# EAGLE design MBED_BBB (EAGLE 6.2)
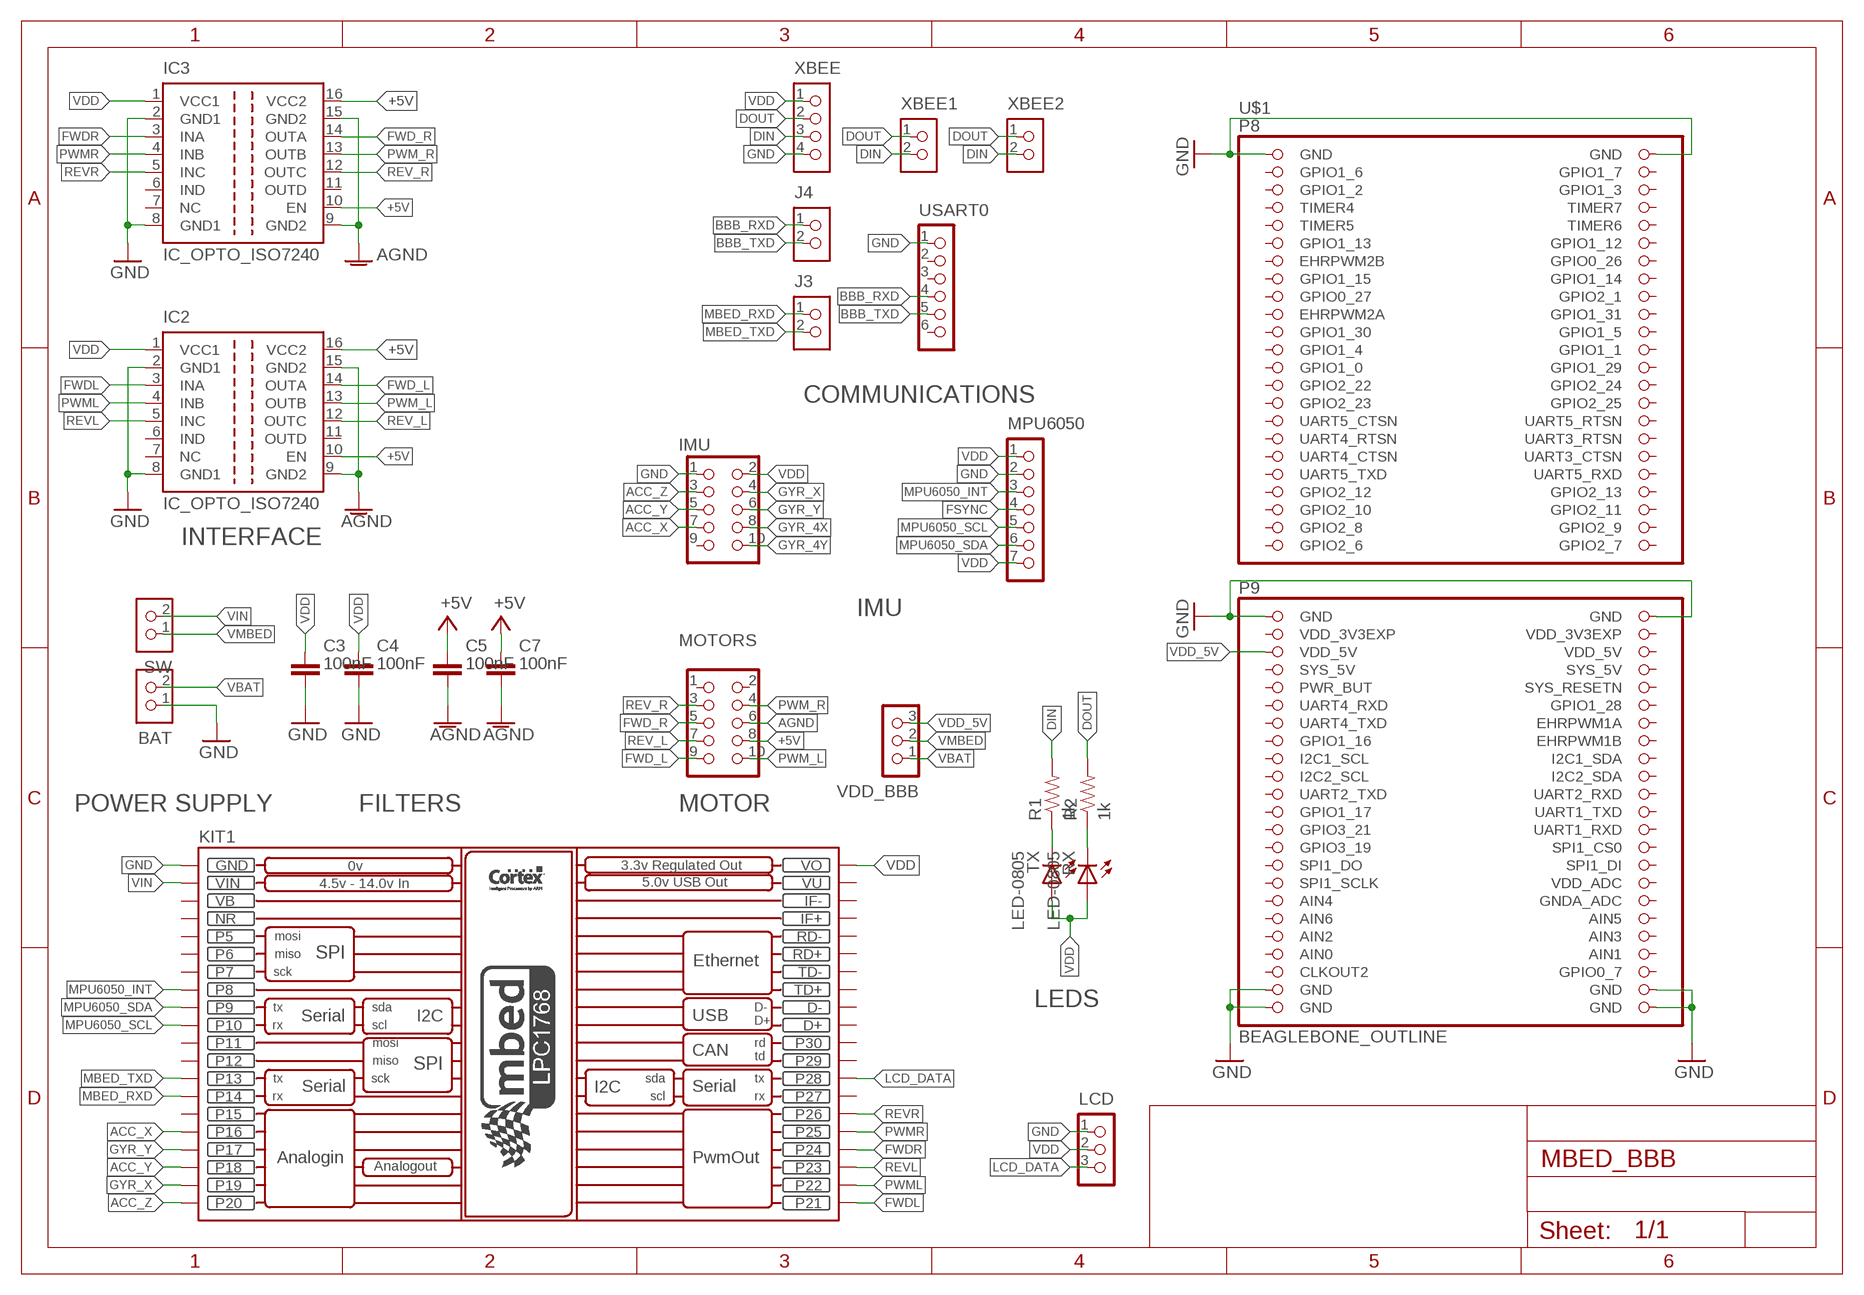
[diagram p0: schematic, sheet 1]

## Parts
BAT  CON_HEADER_1X02-PTH-M  [M1X02_M]
C3  100nF  CAPACITOR-0603  [C0603]
C4  100nF  CAPACITOR-0603  [C0603]
C5  100nF  CAPACITOR-0603  [C0603]
C7  100nF  CAPACITOR-0603  [C0603]
IC2  IC_OPTO_ISO7240  [SOIC-16DW]
IC3  IC_OPTO_ISO7240  [SOIC-16DW]
IMU  CON_HEADER_2X05-PTH+SHROUDED_A  [PINSHRD_PTH_2X05]
J3  CON_HEADER_1X02-PTH-M  [M1X02_M]
J4  CON_HEADER_1X02-PTH-M  [M1X02_M]
KIT1  MBED-SOCKET  [MBED-SOCKET]
LCD  CON_HEADER_1X03-PTH_M  [M1X03_M]
MOTORS  CON_HEADER_2X05-PTH+SHROUDED_A  [PINSHRD_PTH_2X05]
MPU6050  CON_HEADER_1X07-PTH_M  [M1X07_M]
R1  1k  RESISTOR-0603  [R0603]
R2  1k  RESISTOR-0603  [R0603]
RX  LED-0805  [LED-0805]
SW  CON_HEADER_1X02-PTH-POLAR  [M1X02_P]
TX  LED-0805  [LED-0805]
U$1  BEAGLEBONE_OUTLINE  [BEAGLEBONE_SHIELD]
USART0  CON_HEADER_1X06-PTH_M  [M1X06_M]
VDD_BBB  CON_HEADER_1X03-PTH_M  [M1X03_M]
XBEE  CON_HEADER_1X04-PTH_M  [M1X04_M]
XBEE1  CON_HEADER_1X02-PTH-M  [M1X02_M]
XBEE2  CON_HEADER_1X02-PTH-M  [M1X02_M]

## Nets
+5V: C5.1 C7.1 IC2.10(EN) IC2.16(VCC2) IC3.10(EN) IC3.16(VCC2) MOTORS.8
ACC_X: IMU.7 KIT1.P16
ACC_Y: IMU.5 KIT1.P18
ACC_Z: IMU.3 KIT1.P20
AGND: C5.2 C7.2 IC2.9(GND2) IC2.15(GND2) IC3.9(GND2) IC3.15(GND2) MOTORS.6
BBB_RXD: J4.1 USART0.4
BBB_TXD: J4.2 USART0.5
DIN: R1.2 XBEE1.2 XBEE2.2 XBEE.3
DOUT: R2.2 XBEE1.1 XBEE2.1 XBEE.2
FSYNC: MPU6050.4
FWD_L: IC2.14(OUTA) MOTORS.9
FWD_R: IC3.14(OUTA) MOTORS.5
FWDL: IC2.3(INA) KIT1.P21
FWDR: IC3.3(INA) KIT1.P24
GND: BAT.1 C3.2 C4.2 IC2.2(GND1) IC2.8(GND1) IC3.2(GND1) IC3.8(GND1) IMU.1 KIT1.GND LCD.1 MPU6050.2 U$1.1(GND) U$1.2(GND) U$1.47(GND) U$1.48(GND) U$1.89(GND) U$1.90(GND) U$1.91(GND) U$1.92(GND) USART0.1 XBEE.4
GYR_4X: IMU.8
GYR_4Y: IMU.10
GYR_X: IMU.4 KIT1.P19
GYR_Y: IMU.6 KIT1.P17
LCD_DATA: KIT1.P28 LCD.3
MBED_RXD: J3.1 KIT1.P14
MBED_TXD: J3.2 KIT1.P13
MPU6050_INT: KIT1.P8 MPU6050.3
MPU6050_SCL: KIT1.P10 MPU6050.5
MPU6050_SDA: KIT1.P9 MPU6050.6
PWM_L: IC2.13(OUTB) MOTORS.10
PWM_R: IC3.13(OUTB) MOTORS.4
PWML: IC2.4(INB) KIT1.P22
PWMR: IC3.4(INB) KIT1.P25
REV_L: IC2.12(OUTC) MOTORS.7
REV_R: IC3.12(OUTC) MOTORS.3
REVL: IC2.5(INC) KIT1.P23
REVR: IC3.5(INC) KIT1.P26
RX_LED: R2.1 RX.C
TX_LED: R1.1 TX.C
VBAT: BAT.2 VDD_BBB.1
VDD: C3.1 C4.1 IC2.1(VCC1) IC3.1(VCC1) IMU.2 KIT1.VOUT(VO) LCD.2 MPU6050.1 MPU6050.7 RX.A TX.A XBEE.1
VDD_5V: U$1.51(VDD_5V) VDD_BBB.3
VIN: KIT1.VIN SW.2
VMBED: SW.1 VDD_BBB.2
Unconnected: IC2.6(IND) IC2.7(NC) IC2.11(OUTD) IC3.6(IND) IC3.7(NC) IC3.11(OUTD) IMU.9 KIT1.D+ KIT1.D- KIT1.IF+ KIT1.IF- KIT1.P5 KIT1.P6 KIT1.P7 KIT1.P11 KIT1.P12 KIT1.P15 KIT1.P27 KIT1.P29 KIT1.P30 KIT1.RD+ KIT1.RD- KIT1.TD+ KIT1.TD- MOTORS.1 MOTORS.2 U$1.3(GPIO1_6) U$1.4(GPIO1_7) U$1.5(GPIO1_2) U$1.6(GPIO1_3) U$1.7(TIMER4) U$1.8(TIMER7) U$1.9(TIMER5) U$1.10(TIMER6) U$1.11(GPIO1_13) U$1.12(GPIO1_12) U$1.13(EHRPWM2B) U$1.14(GPIO0_26) U$1.15(GPIO1_15) U$1.16(GPIO1_14) U$1.17(GPIO0_27) U$1.18(GPIO2_1) U$1.19(EHRPWM2A) U$1.20(GPIO1_31) U$1.21(GPIO1_30) U$1.22(GPIO1_5) U$1.23(GPIO1_4) U$1.24(GPIO1_1) U$1.25(GPIO1_0) U$1.26(GPIO1_29) U$1.27(GPIO2_22) U$1.28(GPIO2_24) U$1.29(GPIO2_23) U$1.30(GPIO2_25) U$1.31(UART5_CTSN) U$1.32(UART5_RTSN) U$1.33(UART4_RTSN) U$1.34(UART3_RTSN) U$1.35(UART4_CTSN) U$1.36(UART3_CTSN) U$1.37(UART5_TXD) U$1.38(UART5_RXD) U$1.39(GPIO2_12) U$1.40(GPIO2_13) U$1.41(GPIO2_10) U$1.42(GPIO2_11) U$1.43(GPIO2_8) U$1.44(GPIO2_9) U$1.45(GPIO2_6) U$1.46(GPIO2_7) U$1.54(SYS_5V) U$1.55(PWR_BUT) U$1.56(SYS_RESETN) U$1.57(UART4_RXD) U$1.58(GPIO1_28) U$1.59(UART4_TXD) U$1.60(EHRPWM1A) U$1.61(GPIO1_16) U$1.62(EHRPWM1B) U$1.63(I2C1_SCL) U$1.64(I2C1_SDA) U$1.65(I2C2_SCL) U$1.66(I2C2_SDA) U$1.67(UART2_TXD) U$1.68(UART2_RXD) U$1.69(GPIO1_17) U$1.70(UART1_TXD) U$1.71(GPIO3_21) U$1.72(UART1_RXD) U$1.73(GPIO3_19) U$1.74(SPI1_CS0) U$1.75(SPI1_DO) U$1.76(SPI1_DI) U$1.77(SPI1_SCLK) U$1.78(VDD_ADC) U$1.79(AIN4) U$1.80(GNDA_ADC) U$1.81(AIN6) U$1.82(AIN5) U$1.83(AIN2) U$1.84(AIN3) U$1.86(AIN1) U$1.87(CLKOUT2) U$1.88(GPIO0_7) USART0.2 USART0.3 USART0.6

## Notes on the sheet
- COMMUNICATIONS
- INTERFACE
- IMU
- POWER SUPPLY | FILTERS | MOTOR
- LEDS

## Power pins joined to a net without a drawn wire
AIN0: U$1.85(AIN0)
NR: KIT1.NR
SYS_5V: U$1.53(SYS_5V)
VB: KIT1.VB
VDD_3V3EXP: U$1.49(VDD_3V3EXP) U$1.50(VDD_3V3EXP)
VDD_5V: U$1.52(VDD_5V)
VU: KIT1.VU

## Library data of the parts
BAT J3 J4 SW XBEE1 XBEE2 = gary:CON_HEADER_1X02
C3-C5 C7 = gary:CAPACITOR: Non-Polarized capacitor in various packages
IC2 IC3 = gary:IC_OPTO_ISO7240: HIGH SPEED QUAD DIGITAL ISOLATORS Source: http://focus.ti.com/lit/ds/symlink/iso7240m.pdf; MPN: ISO7240MDW; OC_FARNELL: 1755124; OC_NEWARK: 58M0385
IMU MOTORS = gary:CON_HEADER_2X05: 2x05 pin header
KIT1 = gary:MBED: Mbed LPC1768 - ARM CORTEX v2.1 * Schematic symbol is now placed in eagles's default raster. *The pads diameter are suitable for routing between mbed pins * mbed pads are 0.8 mm drill diameter. --------------------------------------------- Created by: Mohamed Yousry *Alexandria, Egypt *Email: mohamed.yousry@ieeegoldegypt.org
LCD VDD_BBB = gary:CON_HEADER_1X03
MPU6050 = gary:CON_HEADER_1X07
R1 R2 = gary:RESISTOR: Resistor Basic schematic elements and footprints for 0603, 1206, and PTH resistors.
RX TX = gary:LED: Light Emitting Diode
U$1 = gary:BEAGLEBONE_OUTLINE: Should match A3 pinout - but not completely tested
USART0 = gary:CON_HEADER_1X06
XBEE = gary:CON_HEADER_1X04

## Board
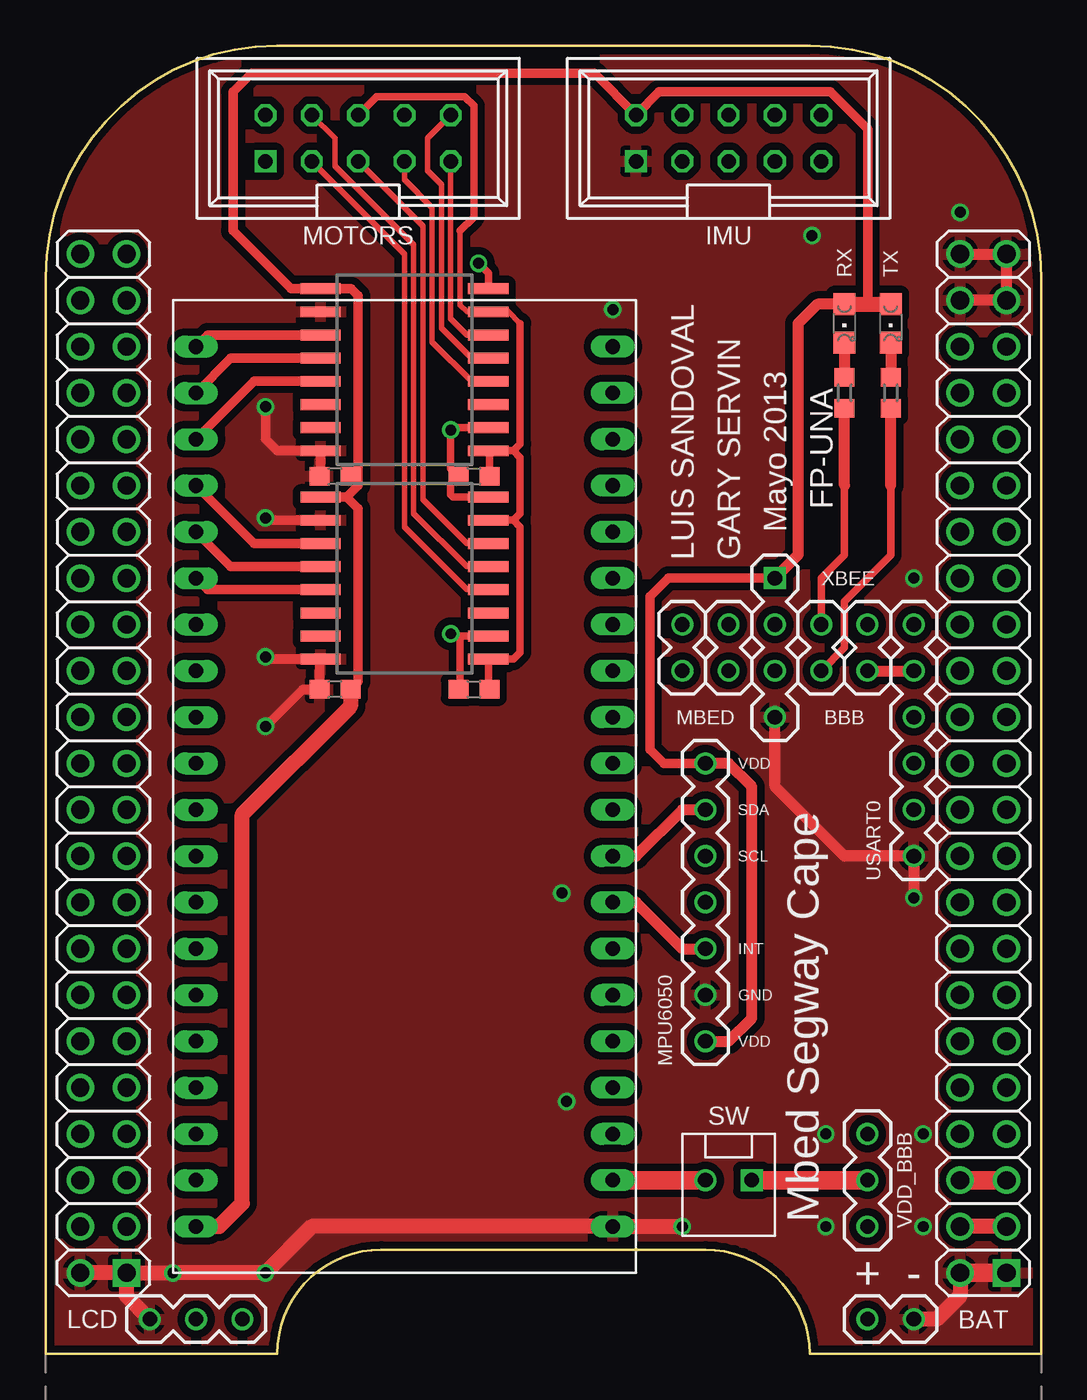
[diagram p1: board, top side]
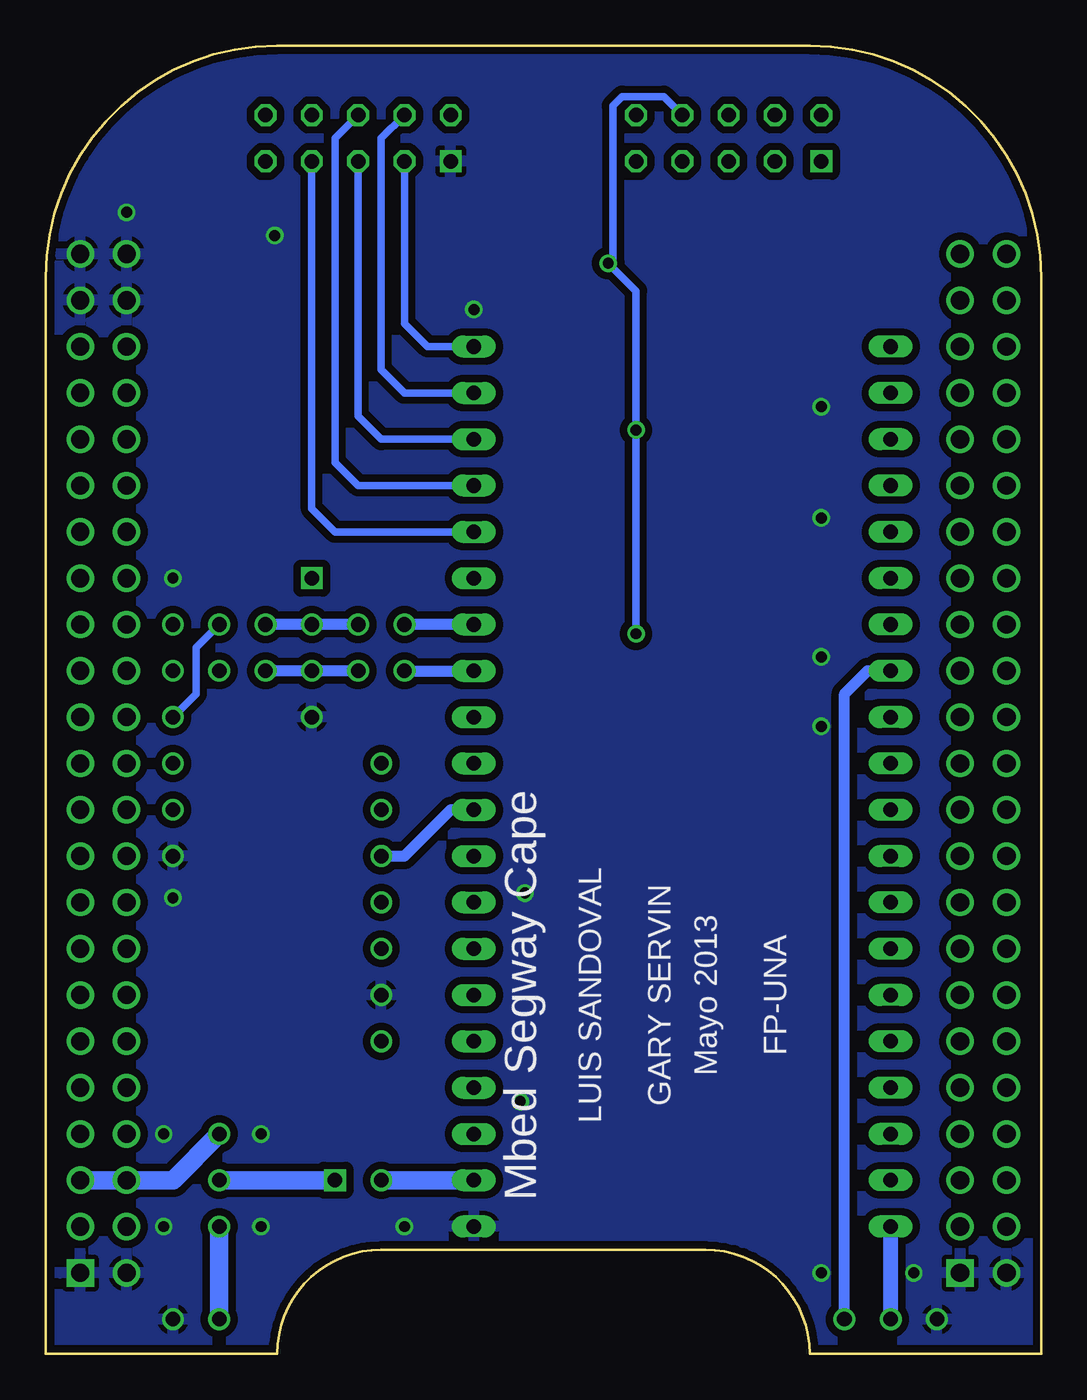
[diagram p2: board, bottom side, seen from below]

Size 54.61 x 71.75 mm. Coordinates in mm from the lower left corner, seen from the top.
Copper layers (1*16): Top 0.0356mm / dielectric 1.5011mm / Bottom 0.0356mm
Design rules: minimum track width 6mil, minimum drill 13mil, track to track 6mil, track to pad 6mil, pad to pad 6mil, via to via 6mil, smd to smd 6mil, copper to edge 15mil, drill to drill 6mil, minimum pad ring 7mil, minimum via ring 7mil, stop-mask expansion 4mil, vias tented up to drill 0mil, thermal gap 10mil

### Footprints (pad centres in the part's own frame; a part is rotated, then mirrored left to right if it is on the bottom)
M1X02_M = drill 0.8: 1 -1.27,0; 2 1.27,0
C0603 = smd 1.1 x 1: 1 -0.85,0; 2 0.85,0
SOIC-16DW = smd 0.6 x 2.2: 1 -4.445,-4.6; 2 -3.175,-4.6; 3 -1.905,-4.6; 4 -0.635,-4.6; 5 0.635,-4.6; 6 1.905,-4.6; 7 3.175,-4.6; 8 4.445,-4.6; 9 4.445,4.6; 10 3.175,4.6; 11 1.905,4.6; 12 0.635,4.6; 13 -0.635,4.6; 14 -1.905,4.6; 15 -3.175,4.6; 16 -4.445,4.6
PINSHRD_PTH_2X05 = drill 0.8 square: 1 -5.08,-1.27 | drill 0.8 octagon: 2 -5.08,1.27; 3 -2.54,-1.27; 4 -2.54,1.27; 5 0,-1.27; 6 0,1.27; 7 2.54,-1.27; 8 2.54,1.27; 9 5.08,-1.27; 10 5.08,1.27
MBED-SOCKET = drill 0.8 long: D+ 11.43,1.27; D- 11.43,3.81; GND -11.43,24.13; IF+ 11.43,16.51; IF- 11.43,19.05; NR -11.43,16.51; P5 -11.43,13.97; P6 -11.43,11.43; P7 -11.43,8.89; P8 -11.43,6.35; P9 -11.43,3.81; P10 -11.43,1.27; P11 -11.43,-1.27; P12 -11.43,-3.81; P13 -11.43,-6.35; P14 -11.43,-8.89; P15 -11.43,-11.43; P16 -11.43,-13.97; P17 -11.43,-16.51; P18 -11.43,-19.05; P19 -11.43,-21.59; P20 -11.43,-24.13; P21 11.43,-24.13; P22 11.43,-21.59; P23 11.43,-19.05; P24 11.43,-16.51; P25 11.43,-13.97; P26 11.43,-11.43; P27 11.43,-8.89; P28 11.43,-6.35; P29 11.43,-3.81; P30 11.43,-1.27; RD+ 11.43,11.43; RD- 11.43,13.97; TD+ 11.43,6.35; TD- 11.43,8.89; VB -11.43,19.05; VIN -11.43,21.59; VOUT 11.43,24.13; VU 11.43,21.59
M1X03_M = drill 0.8: 1 0,0; 2 2.54,0; 3 5.08,0
M1X07_M = drill 0.8: 1 -7.62,0; 2 -5.08,0; 3 -2.54,0; 4 0,0; 5 2.54,0; 6 5.08,0; 7 7.62,0
R0603 = smd 1 x 1.1: 1 -0.85,0; 2 0.85,0
LED-0805 = smd 1.2 x 1.2: A 0,-1.05; C 0,1.05
M1X02_P = drill 0.8 square: 1 0,0 | drill 0.8: 2 2.54,0
BEAGLEBONE_SHIELD = drill 1 square: 1 4.445,19.05; 47 52.705,19.05 | drill 1: 2 1.905,19.05; 3 4.445,21.59; 4 1.905,21.59; 5 4.445,24.13; 6 1.905,24.13; 7 4.445,26.67; 8 1.905,26.67; 9 4.445,29.21; 10 1.905,29.21; 11 4.445,31.75; 12 1.905,31.75; 13 4.445,34.29; 14 1.905,34.29; 15 4.445,36.83; 16 1.905,36.83; 17 4.445,39.37; 18 1.905,39.37; 19 4.445,41.91; 20 1.905,41.91; 21 4.445,44.45; 22 1.905,44.45; 23 4.445,46.99; 24 1.905,46.99; 25 4.445,49.53; 26 1.905,49.53; 27 4.445,52.07; 28 1.905,52.07; 29 4.445,54.61; 30 1.905,54.61; 31 4.445,57.15; 32 1.905,57.15; 33 4.445,59.69; 34 1.905,59.69; 35 4.445,62.23; 36 1.905,62.23; 37 4.445,64.77; 38 1.905,64.77; 39 4.445,67.31; 40 1.905,67.31; 41 4.445,69.85; 42 1.905,69.85; 43 4.445,72.39; 44 1.905,72.39; 45 4.445,74.93; 46 1.905,74.93; 48 50.165,19.05; 49 52.705,21.59; 50 50.165,21.59; 51 52.705,24.13; 52 50.165,24.13; 53 52.705,26.67; 54 50.165,26.67; 55 52.705,29.21; 56 50.165,29.21; 57 52.705,31.75; 58 50.165,31.75; 59 52.705,34.29; 60 50.165,34.29; 61 52.705,36.83; 62 50.165,36.83; 63 52.705,39.37; 64 50.165,39.37; 65 52.705,41.91; 66 50.165,41.91; 67 52.705,44.45; 68 50.165,44.45; 69 52.705,46.99; 70 50.165,46.99; 71 52.705,49.53; 72 50.165,49.53; 73 52.705,52.07; 74 50.165,52.07; 75 52.705,54.61; 76 50.165,54.61; 77 52.705,57.15; 78 50.165,57.15; 79 52.705,59.69; 80 50.165,59.69; 81 52.705,62.23; 82 50.165,62.23; 83 52.705,64.77; 84 50.165,64.77; 85 52.705,67.31; 86 50.165,67.31; 87 52.705,69.85; 88 50.165,69.85; 89 52.705,72.39; 90 50.165,72.39; 91 52.705,74.93; 92 50.165,74.93
M1X06_M = drill 0.8: 1 0,0; 2 2.54,0; 3 5.08,0; 4 7.62,0; 5 10.16,0; 6 12.7,0
M1X04_M = drill 0.8 square: 1 0,0 | drill 0.8: 2 2.54,0; 3 5.08,0; 4 7.62,0

### Placement (x,y rotation side)
BAT  46.36,1.91 180 top
C3  15.88,36.45 180 top
C4  15.88,48.13 180 top
C5  23.49,36.45 0 top
C7  23.49,48.13 0 top
IC2  19.68,53.98 270 top
IC3  19.68,42.55 270 top
IMU  37.47,66.67 0 top
J3  34.93,38.73 270 top
J4  45.09,38.73 270 top
KIT1  19.68,31.12 180 top
LCD  5.71,1.91 0 top
MOTORS  17.14,66.67 0 top
MPU6050  36.2,24.77 90 top
R1  46.36,52.71 270 top
R2  43.82,52.71 270 top
RX  43.82,56.52 180 top
SW  38.73,9.53 180 top
TX  46.36,56.52 180 top
U$1  0,-14.61 0 top
USART0  47.62,27.3 90 top
VDD_BBB  45.09,6.99 90 top
XBEE  40.01,42.55 270 top
XBEE1  42.55,38.73 270 top
XBEE2  37.47,38.73 270 top

### Tracks (layer width: path | path; a pad name or v marks a point on that pad's centre or on a via)
+5V  (via drill 0.6)
  Top 0.305: 22.35,39.37 v22.22,39.5
  Top 0.406: C5.1 22.73,36.54 22.73,39.37 | IC3.10 22.73,39.37 | 22.73,39.37 22.35,39.37 | IC2.10 22.35,50.8 v22.22,50.67 22.22,48.55 C7.1 22.22,47.71 22.22,47.12 22.35,46.99 IC3.16 | IC2.16 24.29,59.28 v23.75,59.82
  Bottom 0.406: MOTORS.8 20.7,68.96 22.99,68.96 23.49,68.45 23.49,60.07 v23.75,59.82 22.22,58.29 v22.22,50.67 v22.22,39.5
ACC_X
  Bottom 0.406: KIT1.P16 38.73,45.09 40.01,46.36 IMU.7
ACC_Y
  Bottom 0.406: KIT1.P18 36.2,50.16 37.47,51.44 IMU.5
ACC_Z
  Bottom 0.406: KIT1.P20 33.66,55.25 34.93,56.52 IMU.3
AGND
  Top 0.305: IC2.9 25.15,49.53 | 26.04,56.52 25.4,57.15 IC2.15 23.11,57.15 22.73,57.53 22.73,61.59
  Top 0.406: C5.2 24.29,36.51 IC3.9 25.65,38.1 26.04,38.48 26.04,45.34 25.65,45.72 | 26.04,56.52 26.04,49.91 25.65,49.53 | IC3.15 25.65,45.72 | MOTORS.6 18.16,68.96 22.99,68.96 23.49,68.45 23.49,62.36 22.73,61.59 | C7.2 24.34,49.47 IC2.9 | 25.65,45.72 26.04,46.1 26.04,49.15 25.65,49.53 | 25.15,49.53 25.65,49.53
BBB_RXD
  Bottom 0.406: USART0.4 46.36,36.2 46.36,38.73 J4.1
BBB_TXD
  Top 0.61: J4.2 USART0.5
DIN
  Top 0.406: XBEE1.2 43.82,38.73 43.82,41.27 46.36,43.82 46.36,47.62
  Top 0.61: 46.36,47.62 R1.2
  Bottom 0.61: XBEE2.2 XBEE.3 XBEE1.2
DOUT
  Top 0.406: 43.82,47.62 43.82,43.82 42.55,42.55 XBEE1.1
  Top 0.61: 43.82,47.62 R2.2
  Bottom 0.61: XBEE2.1 XBEE.2 XBEE1.1
FWD_L
  Top 0.305: IC2.14 23.11,55.88 22.22,56.77 MOTORS.9
FWD_R
  Top 0.305: IC3.14 23.11,44.45 20.7,46.86 20.7,61.85 MOTORS.5
FWDL
  Top 0.508: IC2.3 8.89,55.88 KIT1.P21
FWDR
  Top 0.508: IC3.3 11.43,44.45 KIT1.P24
GND  (via drill 0.6)
  Top 0.508: v12.06,51.94 12.06,50.16 12.7,49.53 IC2.8 15.09,48.19 C4.2 | IC3.2 12.19,45.72 v12.06,45.85 | v12.06,38.23 12.19,38.1 IC3.8 15.03,38.04 C3.2 14.1,36.45 v12.06,34.42
  Top 0.61: U$1.92 U$1.91 U$1.89 U$1.90 | v47.62,25.02 USART0.1 43.82,27.3 40.01,31.12 XBEE.4
  Top 0.813: U$1.1 U$1.2 | U$1.1 v6.99,4.45 v12.06,4.45 14.61,6.99 KIT1.GND v34.93,6.99 | LCD.1 4.45,3.18 U$1.1 | U$1.48 50.16,3.18 48.9,1.91 BAT.1
  Top 1.016: U$1.47 U$1.48
  other vias: 50.16,62.61 47.62,42.55 42.04,61.34 31.11,57.28 28.32,25.27 28.57,13.84 48.13,6.99 48.13,12.06 42.8,6.99 42.8,12.06
  pour Bottom (isolate 0.406): -0.64,-0.63 55.25,-0.63 55.25,71.75 -0.64,71.75
  pour Top (isolate 0.406): -0.64,-0.63 55.25,-0.63 55.25,71.75 -0.64,71.75
GYR_X
  Bottom 0.406: KIT1.P19 34.93,52.71 36.2,53.98 36.2,66.67 IMU.4
GYR_Y
  Bottom 0.406: KIT1.P17 37.47,47.62 38.73,48.9 38.73,66.67 IMU.6
LCD_DATA
  Bottom 0.61: KIT1.P28 9.53,37.47 10.79,36.2 LCD.3
MBED_RXD
  Bottom 0.61: KIT1.P14 J3.1
MBED_TXD
  Bottom 0.61: J3.2 KIT1.P13
MPU6050_INT
  Top 0.61: KIT1.P8 32.39,24.77 34.93,22.23 MPU6050.3
MPU6050_SCL
  Bottom 0.61: KIT1.P10 32.39,29.84 34.93,27.3 MPU6050.5
MPU6050_SDA
  Top 0.61: KIT1.P9 32.39,27.3 34.93,29.84 MPU6050.6
PWM_L
  Top 0.305: IC2.13 23.37,54.61 21.72,56.26 21.72,64.13 20.95,64.9 20.95,66.67 MOTORS.10
PWM_R
  Top 0.305: MOTORS.4 15.88,66.67 15.88,65.15 20.19,60.83 20.19,46.1 23.11,43.18 IC3.13
PWML
  Top 0.508: IC2.4 10.16,54.61 KIT1.P22
PWMR
  Top 0.508: IC3.4 10.16,43.18 KIT1.P25
REV_L
  Top 0.305: IC2.12 23.37,53.34 21.21,55.5 21.21,62.87 19.68,64.39 MOTORS.7
REV_R
  Top 0.305: MOTORS.3 19.68,60.33 19.68,45.34 23.11,41.91 IC3.12
REVL
  Top 0.508: IC2.5 11.43,53.34 KIT1.P23
REVR
  Top 0.508: IC3.5 8.89,41.91 KIT1.P26
RX_LED
  Top 0.61: RX.C R2.1
TX_LED
  Top 0.61: TX.C R1.1
VBAT
  Bottom 1.016: BAT.2 VDD_BBB.1
VDD
  Top 0.406: C3.1 16.89,36.45 | 15.2,47.11 IC3.1 | C4.1 17.14,48.13
  Top 0.508: 16.51,46.99 17.14,47.62 17.14,48.13 17.14,58.04 16.76,58.42 IC2.1 13.46,58.42 10.29,61.59 10.29,69.21 11.3,70.23 30.1,70.23 IMU.2 33.66,69.21 43.05,69.21 45.1,67.17 45.1,57.57 | IC3.1 16.51,46.99 | 16.51,46.99 17.14,46.36 17.14,36.87 C3.1 | 37.47,32.39 33.91,32.39 33.15,33.15 33.15,41.53 34.16,42.55 XBEE.1
  Top 0.61: MPU6050.1 37.47,17.15 38.73,18.41 38.73,31.12 37.47,32.39 MPU6050.7 | XBEE.1 41.27,43.82 41.27,56.52 42.33,57.57 RX.A
  Top 0.813: RX.A 45.1,57.57 TX.A | KIT1.VOUT 9.53,6.99 10.79,8.26 10.79,29.59 16.72,35.52 C3.1
  Bottom 0.813: LCD.2 KIT1.VOUT
VDD_3V3EXP
  Top 0.813: U$1.49 U$1.50
VDD_5V
  Top 1.016: U$1.52 U$1.51
  Bottom 1.016: U$1.51 U$1.52 47.62,9.53 VDD_BBB.3
VIN
  Top 1.016: SW.2 KIT1.VIN
  Bottom 1.016: KIT1.VIN SW.2
VMBED
  Top 1.016: SW.1 VDD_BBB.2
  Bottom 1.016: VDD_BBB.2 SW.1

### Text on the board
tNames: FP-UNA | Mayo 2013 | LUIS SANDOVAL | GARY SERVIN | MBED | BBB | VDD | SDA | SCL | INT | GND | VDD | SW | Mbed Segway Cape | + | -
bNames: FP-UNA | Mayo 2013 | GARY SERVIN | LUIS SANDOVAL | Mbed Segway Cape